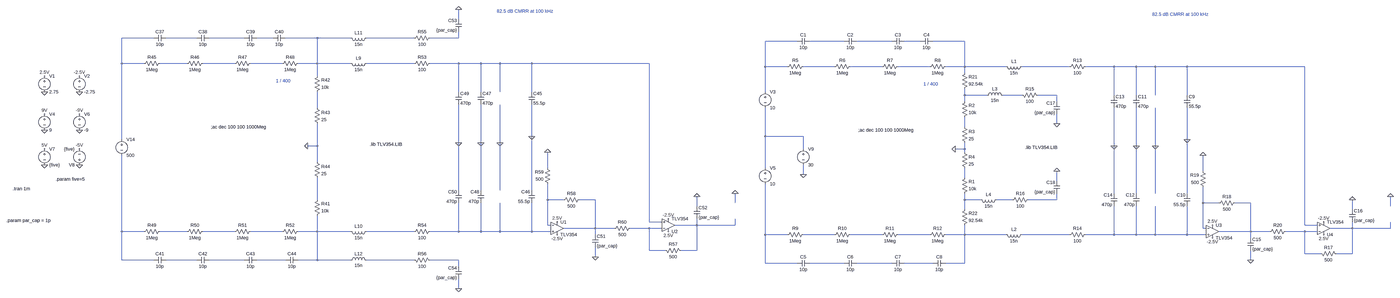
[diagram p0: schematic ratio_analysis.asc, whole sheet]
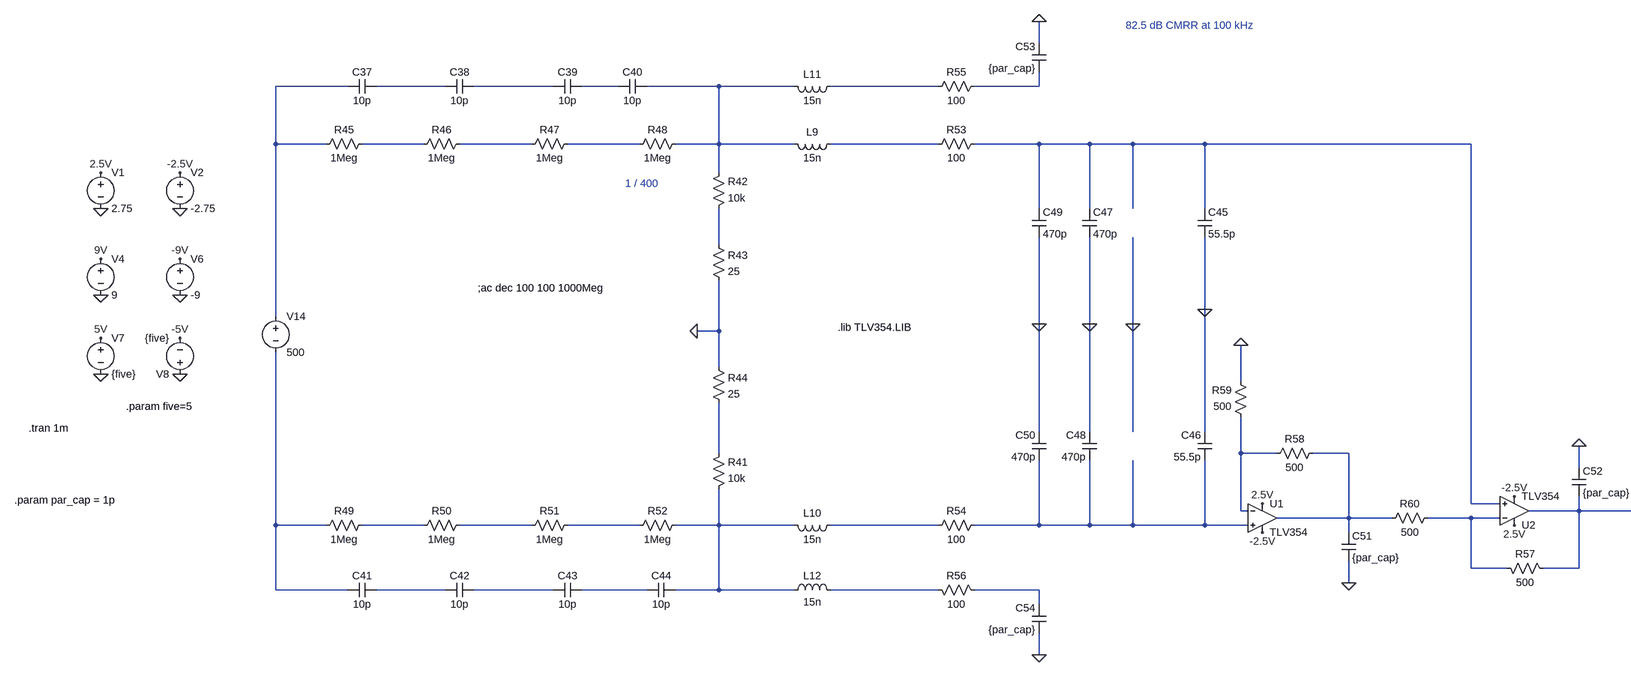
[diagram p1: schematic ratio_analysis.asc, part, row 1 of 1, column 1 of 2]
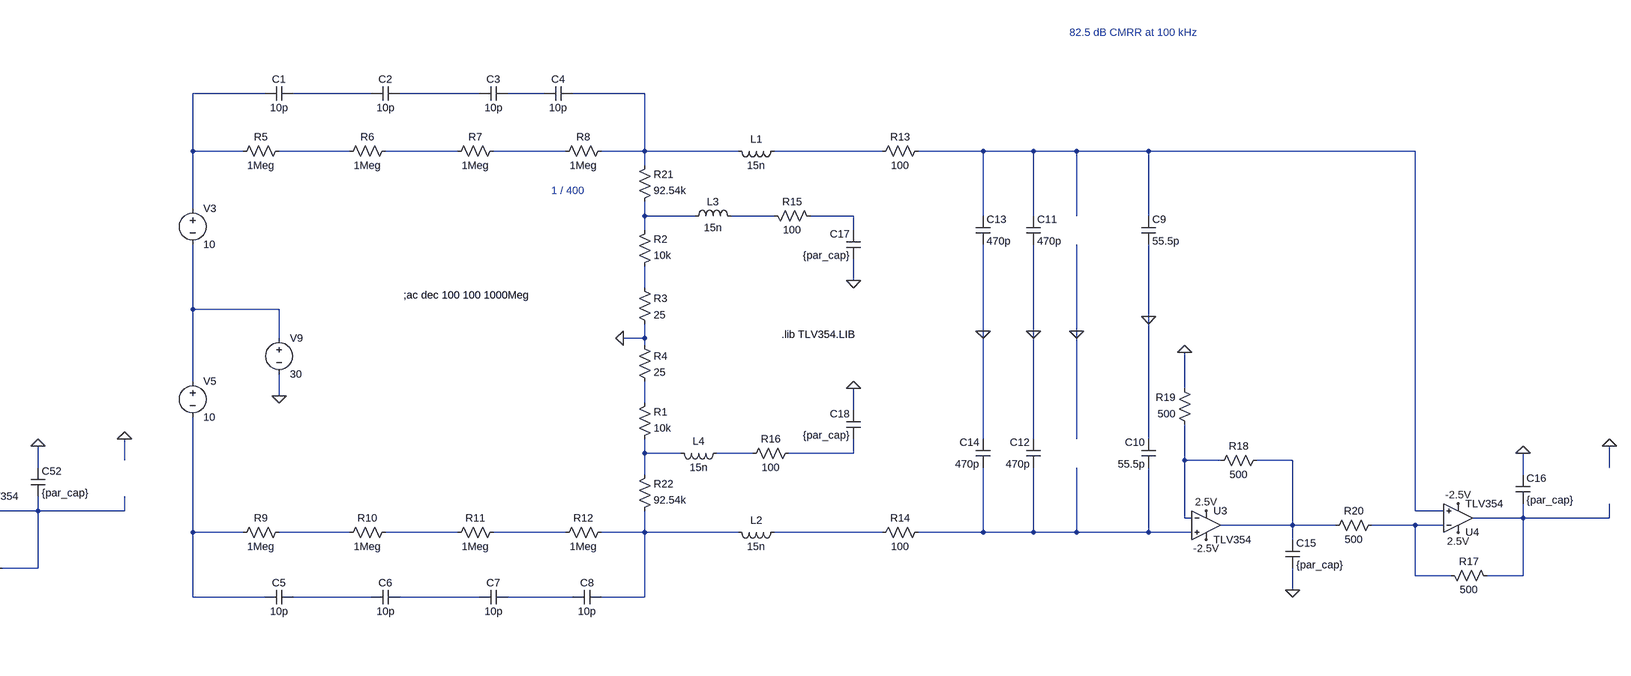
[diagram p2: schematic ratio_analysis.asc, part, row 1 of 1, column 2 of 2]
ratio_analysis.asc, the LTspice schematic file:
Version 4
SHEET 1 7348 2628
WIRE 2144 -544 2144 -592
WIRE 544 -448 384 -448
WIRE 784 -448 608 -448
WIRE 1024 -448 848 -448
WIRE 1168 -448 1088 -448
WIRE 1392 -448 1232 -448
WIRE 1600 -448 1392 -448
WIRE 1920 -448 1680 -448
WIRE 2144 -448 2144 -480
WIRE 2144 -448 2000 -448
WIRE 3936 -432 3776 -432
WIRE 4176 -432 4000 -432
WIRE 4416 -432 4240 -432
WIRE 4560 -432 4480 -432
WIRE 4784 -432 4624 -432
WIRE 384 -320 384 -448
WIRE 496 -320 384 -320
WIRE 736 -320 576 -320
WIRE 976 -320 816 -320
WIRE 1216 -320 1056 -320
WIRE 1392 -320 1392 -448
WIRE 1392 -320 1296 -320
WIRE 1600 -320 1392 -320
WIRE 1920 -320 1680 -320
WIRE 2144 -320 2000 -320
WIRE 2256 -320 2144 -320
WIRE 2352 -320 2256 -320
WIRE 2512 -320 2352 -320
WIRE 3104 -320 2512 -320
WIRE 3776 -304 3776 -432
WIRE 3888 -304 3776 -304
WIRE 4128 -304 3968 -304
WIRE 4368 -304 4208 -304
WIRE 4608 -304 4448 -304
WIRE 4784 -304 4784 -432
WIRE 4784 -304 4688 -304
WIRE 4992 -304 4784 -304
WIRE 5312 -304 5072 -304
WIRE 5536 -304 5392 -304
WIRE 5648 -304 5536 -304
WIRE 5744 -304 5648 -304
WIRE 5904 -304 5744 -304
WIRE 6496 -304 5904 -304
WIRE 4784 -272 4784 -304
WIRE 1392 -256 1392 -320
WIRE 2144 -176 2144 -320
WIRE 2256 -176 2256 -320
WIRE 2352 -176 2352 -320
WIRE 2512 -176 2512 -320
WIRE 3776 -176 3776 -304
WIRE 4784 -160 4784 -192
WIRE 4896 -160 4784 -160
WIRE 5072 -160 4976 -160
WIRE 5248 -160 5152 -160
WIRE 5536 -160 5536 -304
WIRE 5648 -160 5648 -304
WIRE 5744 -160 5744 -304
WIRE 5904 -160 5904 -304
WIRE 4784 -128 4784 -160
WIRE 5248 -128 5248 -160
WIRE 1392 -96 1392 -176
WIRE 5248 -16 5248 -64
WIRE 4784 0 4784 -48
WIRE 2512 48 2512 -112
WIRE 3776 48 3776 -96
WIRE 3968 48 3776 48
WIRE 384 64 384 -320
WIRE 5904 64 5904 -96
WIRE 2144 80 2144 -112
WIRE 2256 80 2256 -112
WIRE 2352 80 2352 -112
WIRE 1392 96 1392 -16
WIRE 1392 96 1344 96
WIRE 5536 96 5536 -96
WIRE 5648 96 5648 -96
WIRE 5744 96 5744 -96
WIRE 3968 112 3968 48
WIRE 4784 112 4784 80
WIRE 4784 112 4736 112
WIRE 4784 128 4784 112
WIRE 1392 176 1392 96
WIRE 2592 208 2592 128
WIRE 3776 208 3776 48
WIRE 5984 224 5984 144
WIRE 3968 240 3968 192
WIRE 4784 256 4784 208
WIRE 5248 272 5248 224
WIRE 2144 320 2144 80
WIRE 2256 320 2256 80
WIRE 2352 320 2352 80
WIRE 2512 320 2512 48
WIRE 5536 336 5536 96
WIRE 5648 336 5648 96
WIRE 5744 336 5744 96
WIRE 5904 336 5904 64
WIRE 1392 368 1392 256
WIRE 2592 368 2592 288
WIRE 2672 368 2592 368
WIRE 2832 368 2752 368
WIRE 4784 368 4784 336
WIRE 4864 368 4784 368
WIRE 5024 368 4944 368
WIRE 5248 368 5248 336
WIRE 5248 368 5104 368
WIRE 3536 384 3536 336
WIRE 5984 384 5984 304
WIRE 6064 384 5984 384
WIRE 6224 384 6144 384
WIRE 3344 400 3344 352
WIRE 6928 400 6928 352
WIRE 4784 416 4784 368
WIRE 6736 416 6736 368
WIRE 3104 480 3104 -320
WIRE 3168 480 3104 480
WIRE 2592 496 2592 368
WIRE 2608 496 2592 496
WIRE 3344 496 3344 464
WIRE 3344 496 3232 496
WIRE 3536 496 3536 464
WIRE 3536 496 3344 496
WIRE 6496 496 6496 -304
WIRE 6560 496 6496 496
WIRE 2832 512 2832 368
WIRE 2832 512 2672 512
WIRE 2928 512 2832 512
WIRE 3104 512 3008 512
WIRE 3168 512 3104 512
WIRE 5984 512 5984 384
WIRE 6000 512 5984 512
WIRE 6736 512 6736 480
WIRE 6736 512 6624 512
WIRE 6928 512 6928 480
WIRE 6928 512 6736 512
WIRE 384 528 384 144
WIRE 496 528 384 528
WIRE 736 528 576 528
WIRE 976 528 816 528
WIRE 1216 528 1056 528
WIRE 1392 528 1392 448
WIRE 1392 528 1296 528
WIRE 1600 528 1392 528
WIRE 1920 528 1680 528
WIRE 2144 528 2144 384
WIRE 2144 528 2000 528
WIRE 2256 528 2256 384
WIRE 2256 528 2144 528
WIRE 2352 528 2352 384
WIRE 2352 528 2256 528
WIRE 2512 528 2512 384
WIRE 2512 528 2352 528
WIRE 2608 528 2512 528
WIRE 6224 528 6224 384
WIRE 6224 528 6064 528
WIRE 6320 528 6224 528
WIRE 6496 528 6400 528
WIRE 6560 528 6496 528
WIRE 2832 544 2832 512
WIRE 3776 544 3776 288
WIRE 3888 544 3776 544
WIRE 4128 544 3968 544
WIRE 4368 544 4208 544
WIRE 4608 544 4448 544
WIRE 4784 544 4784 496
WIRE 4784 544 4688 544
WIRE 4992 544 4784 544
WIRE 5312 544 5072 544
WIRE 5536 544 5536 400
WIRE 5536 544 5392 544
WIRE 5648 544 5648 400
WIRE 5648 544 5536 544
WIRE 5744 544 5744 400
WIRE 5744 544 5648 544
WIRE 5904 544 5904 400
WIRE 5904 544 5744 544
WIRE 6000 544 5904 544
WIRE 6224 560 6224 528
WIRE 3104 624 3104 512
WIRE 3184 624 3104 624
WIRE 3344 624 3344 496
WIRE 3344 624 3264 624
WIRE 6496 640 6496 528
WIRE 6576 640 6496 640
WIRE 6736 640 6736 512
WIRE 6736 640 6656 640
WIRE 2832 656 2832 608
WIRE 384 672 384 528
WIRE 544 672 384 672
WIRE 784 672 608 672
WIRE 1024 672 848 672
WIRE 1232 672 1088 672
WIRE 1392 672 1392 528
WIRE 1392 672 1296 672
WIRE 1600 672 1392 672
WIRE 1920 672 1680 672
WIRE 2144 672 2000 672
WIRE 6224 672 6224 624
WIRE 3776 688 3776 544
WIRE 3936 688 3776 688
WIRE 4176 688 4000 688
WIRE 4416 688 4240 688
WIRE 4624 688 4480 688
WIRE 4784 688 4784 544
WIRE 4784 688 4688 688
WIRE 2144 704 2144 672
WIRE 2144 816 2144 768
FLAG -80 -176 0
FLAG -80 -256 2.5V
FLAG 96 -176 0
FLAG 96 -256 -2.5V
FLAG -80 16 0
FLAG -80 -64 9V
FLAG 96 16 0
FLAG 96 -64 -9V
FLAG -80 192 0
FLAG -80 112 5V
FLAG 96 192 0
FLAG 96 112 -5V
FLAG 1344 96 0
FLAG 2352 80 0
FLAG 2512 48 0
FLAG 3200 528 2.5V
FLAG 3200 464 -2.5V
FLAG 2256 80 0
FLAG 2640 480 2.5V
FLAG 2640 544 -2.5V
FLAG 2144 80 0
FLAG 2832 656 0
FLAG 3344 352 0
FLAG 2144 -592 0
FLAG 2144 816 0
FLAG 3536 336 0
FLAG 2592 128 0
FLAG 4736 112 0
FLAG 5744 96 0
FLAG 5904 64 0
FLAG 6592 544 2.5V
FLAG 6592 480 -2.5V
FLAG 5648 96 0
FLAG 6032 496 2.5V
FLAG 6032 560 -2.5V
FLAG 5536 96 0
FLAG 6224 672 0
FLAG 6736 368 0
FLAG 5248 -16 0
FLAG 5248 224 0
FLAG 6928 352 0
FLAG 5984 144 0
FLAG 3968 240 0
SYMBOL voltage -80 -272 R0
SYMATTR InstName V1
SYMATTR Value 2.75
SYMBOL voltage 96 -272 R0
SYMATTR InstName V2
SYMATTR Value -2.75
SYMBOL voltage -80 -80 R0
SYMATTR InstName V4
SYMATTR Value 9
SYMBOL voltage 96 -80 R0
SYMATTR InstName V6
SYMATTR Value -9
SYMBOL voltage -80 96 R0
SYMATTR InstName V7
SYMATTR Value {five}
SYMBOL voltage 96 208 R180
WINDOW 123 0 0 Left 0
WINDOW 39 0 0 Left 0
SYMATTR InstName V8
SYMATTR Value {five}
SYMBOL res 1376 464 M180
WINDOW 0 36 76 Left 2
WINDOW 3 36 40 Left 2
SYMATTR InstName R41
SYMATTR Value 10k
SYMBOL cap 608 -464 R90
WINDOW 0 0 32 VBottom 2
WINDOW 3 32 32 VTop 2
SYMATTR InstName C37
SYMATTR Value 10p
SYMBOL cap 848 -464 R90
WINDOW 0 0 32 VBottom 2
WINDOW 3 32 32 VTop 2
SYMATTR InstName C38
SYMATTR Value 10p
SYMBOL cap 1088 -464 R90
WINDOW 0 0 32 VBottom 2
WINDOW 3 32 32 VTop 2
SYMATTR InstName C39
SYMATTR Value 10p
SYMBOL cap 1232 -464 R90
WINDOW 0 0 32 VBottom 2
WINDOW 3 32 32 VTop 2
SYMATTR InstName C40
SYMATTR Value 10p
SYMBOL cap 608 656 R90
WINDOW 0 0 32 VBottom 2
WINDOW 3 32 32 VTop 2
SYMATTR InstName C41
SYMATTR Value 10p
SYMBOL cap 848 656 R90
WINDOW 0 0 32 VBottom 2
WINDOW 3 32 32 VTop 2
SYMATTR InstName C42
SYMATTR Value 10p
SYMBOL cap 1088 656 R90
WINDOW 0 0 32 VBottom 2
WINDOW 3 32 32 VTop 2
SYMATTR InstName C43
SYMATTR Value 10p
SYMBOL cap 1296 656 R90
WINDOW 0 0 32 VBottom 2
WINDOW 3 32 32 VTop 2
SYMATTR InstName C44
SYMATTR Value 10p
SYMBOL cap 2496 -176 R0
SYMATTR InstName C45
SYMATTR Value 55.5p
SYMBOL cap 2528 384 R180
WINDOW 0 24 56 Left 2
WINDOW 3 24 8 Left 2
SYMATTR InstName C46
SYMATTR Value 55.5p
SYMBOL res 1376 -160 M180
WINDOW 0 36 76 Left 2
WINDOW 3 36 40 Left 2
SYMATTR InstName R42
SYMATTR Value 10k
SYMBOL voltage 384 48 R0
WINDOW 123 0 0 Left 0
WINDOW 39 0 0 Left 0
SYMATTR InstName V14
SYMATTR Value 500
SYMBOL cap 2240 -176 R0
SYMATTR InstName C47
SYMATTR Value 470p
SYMBOL cap 2272 384 R180
WINDOW 0 24 56 Left 2
WINDOW 3 24 8 Left 2
SYMATTR InstName C48
SYMATTR Value 470p
SYMBOL res 1376 -112 R0
SYMATTR InstName R43
SYMATTR Value 25
SYMBOL res 1376 160 R0
SYMATTR InstName R44
SYMATTR Value 25
SYMBOL cap 2128 -176 R0
SYMATTR InstName C49
SYMATTR Value 470p
SYMBOL cap 2160 384 R180
WINDOW 0 24 56 Left 2
WINDOW 3 24 8 Left 2
SYMATTR InstName C50
SYMATTR Value 470p
SYMBOL cap 2816 544 R0
SYMATTR InstName C51
SYMATTR Value {par_cap}
SYMBOL cap 3328 464 M180
WINDOW 0 24 56 Left 2
WINDOW 3 24 8 Left 2
SYMATTR InstName C52
SYMATTR Value {par_cap}
SYMBOL ind 1696 -336 R90
WINDOW 0 5 56 VBottom 2
WINDOW 3 32 56 VTop 2
SYMATTR InstName L9
SYMATTR Value 15n
SYMBOL res 592 -336 R90
WINDOW 0 0 56 VBottom 2
WINDOW 3 32 56 VTop 2
SYMATTR InstName R45
SYMATTR Value 1Meg
SYMBOL res 832 -336 R90
WINDOW 0 0 56 VBottom 2
WINDOW 3 32 56 VTop 2
SYMATTR InstName R46
SYMATTR Value 1Meg
SYMBOL res 1072 -336 R90
WINDOW 0 0 56 VBottom 2
WINDOW 3 32 56 VTop 2
SYMATTR InstName R47
SYMATTR Value 1Meg
SYMBOL res 1312 -336 R90
WINDOW 0 0 56 VBottom 2
WINDOW 3 32 56 VTop 2
SYMATTR InstName R48
SYMATTR Value 1Meg
SYMBOL res 592 512 R90
WINDOW 0 0 56 VBottom 2
WINDOW 3 32 56 VTop 2
SYMATTR InstName R49
SYMATTR Value 1Meg
SYMBOL res 832 512 R90
WINDOW 0 0 56 VBottom 2
WINDOW 3 32 56 VTop 2
SYMATTR InstName R50
SYMATTR Value 1Meg
SYMBOL res 1072 512 R90
WINDOW 0 0 56 VBottom 2
WINDOW 3 32 56 VTop 2
SYMATTR InstName R51
SYMATTR Value 1Meg
SYMBOL res 1312 512 R90
WINDOW 0 0 56 VBottom 2
WINDOW 3 32 56 VTop 2
SYMATTR InstName R52
SYMATTR Value 1Meg
SYMBOL ind 1696 512 R90
WINDOW 0 5 56 VBottom 2
WINDOW 3 32 56 VTop 2
SYMATTR InstName L10
SYMATTR Value 15n
SYMBOL res 2016 -336 R90
WINDOW 0 0 56 VBottom 2
WINDOW 3 32 56 VTop 2
SYMATTR InstName R53
SYMATTR Value 100
SYMBOL res 2016 512 R90
WINDOW 0 0 56 VBottom 2
WINDOW 3 32 56 VTop 2
SYMATTR InstName R54
SYMATTR Value 100
SYMBOL ind 1696 -464 R90
WINDOW 0 5 56 VBottom 2
WINDOW 3 32 56 VTop 2
SYMATTR InstName L11
SYMATTR Value 15n
SYMBOL res 2016 -464 R90
WINDOW 0 0 56 VBottom 2
WINDOW 3 32 56 VTop 2
SYMATTR InstName R55
SYMATTR Value 100
SYMBOL cap 2160 -480 R180
WINDOW 0 24 56 Left 2
WINDOW 3 24 8 Left 2
SYMATTR InstName C53
SYMATTR Value {par_cap}
SYMBOL ind 1696 688 M270
WINDOW 0 32 56 VTop 2
WINDOW 3 5 56 VBottom 2
SYMATTR InstName L12
SYMATTR Value 15n
SYMBOL res 2016 688 M270
WINDOW 0 32 56 VTop 2
WINDOW 3 0 56 VBottom 2
SYMATTR InstName R56
SYMATTR Value 100
SYMBOL cap 2160 704 M0
SYMATTR InstName C54
SYMATTR Value {par_cap}
SYMBOL res 3280 640 M270
WINDOW 0 32 56 VTop 2
WINDOW 3 0 56 VBottom 2
SYMATTR InstName R57
SYMATTR Value 500
SYMBOL res 2768 352 R90
WINDOW 0 0 56 VBottom 2
WINDOW 3 32 56 VTop 2
SYMATTR InstName R58
SYMATTR Value 500
SYMBOL res 2608 304 R180
WINDOW 0 36 76 Left 2
WINDOW 3 36 40 Left 2
SYMATTR InstName R59
SYMATTR Value 500
SYMBOL res 3024 496 R90
WINDOW 0 0 56 VBottom 2
WINDOW 3 32 56 VTop 2
SYMATTR InstName R60
SYMATTR Value 500
SYMBOL OpAmps\\opamp2 2640 448 R0
SYMATTR InstName U1
SYMATTR Value TLV354
SYMBOL OpAmps\\opamp2 3200 560 M180
SYMATTR InstName U2
SYMATTR Value TLV354
SYMBOL res 4768 352 M180
WINDOW 0 36 76 Left 2
WINDOW 3 36 40 Left 2
SYMATTR InstName R1
SYMATTR Value 10k
SYMBOL cap 4000 -448 R90
WINDOW 0 0 32 VBottom 2
WINDOW 3 32 32 VTop 2
SYMATTR InstName C1
SYMATTR Value 10p
SYMBOL cap 4240 -448 R90
WINDOW 0 0 32 VBottom 2
WINDOW 3 32 32 VTop 2
SYMATTR InstName C2
SYMATTR Value 10p
SYMBOL cap 4480 -448 R90
WINDOW 0 0 32 VBottom 2
WINDOW 3 32 32 VTop 2
SYMATTR InstName C3
SYMATTR Value 10p
SYMBOL cap 4624 -448 R90
WINDOW 0 0 32 VBottom 2
WINDOW 3 32 32 VTop 2
SYMATTR InstName C4
SYMATTR Value 10p
SYMBOL cap 4000 672 R90
WINDOW 0 0 32 VBottom 2
WINDOW 3 32 32 VTop 2
SYMATTR InstName C5
SYMATTR Value 10p
SYMBOL cap 4240 672 R90
WINDOW 0 0 32 VBottom 2
WINDOW 3 32 32 VTop 2
SYMATTR InstName C6
SYMATTR Value 10p
SYMBOL cap 4480 672 R90
WINDOW 0 0 32 VBottom 2
WINDOW 3 32 32 VTop 2
SYMATTR InstName C7
SYMATTR Value 10p
SYMBOL cap 4688 672 R90
WINDOW 0 0 32 VBottom 2
WINDOW 3 32 32 VTop 2
SYMATTR InstName C8
SYMATTR Value 10p
SYMBOL cap 5888 -160 R0
SYMATTR InstName C9
SYMATTR Value 55.5p
SYMBOL cap 5920 400 R180
WINDOW 0 24 56 Left 2
WINDOW 3 24 8 Left 2
SYMATTR InstName C10
SYMATTR Value 55.5p
SYMBOL res 4768 -32 M180
WINDOW 0 36 76 Left 2
WINDOW 3 36 40 Left 2
SYMATTR InstName R2
SYMATTR Value 10k
SYMBOL voltage 3776 -192 R0
WINDOW 123 0 0 Left 0
WINDOW 39 0 0 Left 0
SYMATTR InstName V3
SYMATTR Value 10
SYMBOL cap 5632 -160 R0
SYMATTR InstName C11
SYMATTR Value 470p
SYMBOL cap 5664 400 R180
WINDOW 0 24 56 Left 2
WINDOW 3 24 8 Left 2
SYMATTR InstName C12
SYMATTR Value 470p
SYMBOL res 4768 -16 R0
SYMATTR InstName R3
SYMATTR Value 25
SYMBOL res 4768 112 R0
SYMATTR InstName R4
SYMATTR Value 25
SYMBOL cap 5520 -160 R0
SYMATTR InstName C13
SYMATTR Value 470p
SYMBOL cap 5552 400 R180
WINDOW 0 24 56 Left 2
WINDOW 3 24 8 Left 2
SYMATTR InstName C14
SYMATTR Value 470p
SYMBOL cap 6208 560 R0
SYMATTR InstName C15
SYMATTR Value {par_cap}
SYMBOL cap 6720 480 M180
WINDOW 0 24 56 Left 2
WINDOW 3 24 8 Left 2
SYMATTR InstName C16
SYMATTR Value {par_cap}
SYMBOL ind 5088 -320 R90
WINDOW 0 5 56 VBottom 2
WINDOW 3 32 56 VTop 2
SYMATTR InstName L1
SYMATTR Value 15n
SYMBOL res 3984 -320 R90
WINDOW 0 0 56 VBottom 2
WINDOW 3 32 56 VTop 2
SYMATTR InstName R5
SYMATTR Value 1Meg
SYMBOL res 4224 -320 R90
WINDOW 0 0 56 VBottom 2
WINDOW 3 32 56 VTop 2
SYMATTR InstName R6
SYMATTR Value 1Meg
SYMBOL res 4464 -320 R90
WINDOW 0 0 56 VBottom 2
WINDOW 3 32 56 VTop 2
SYMATTR InstName R7
SYMATTR Value 1Meg
SYMBOL res 4704 -320 R90
WINDOW 0 0 56 VBottom 2
WINDOW 3 32 56 VTop 2
SYMATTR InstName R8
SYMATTR Value 1Meg
SYMBOL res 3984 528 R90
WINDOW 0 0 56 VBottom 2
WINDOW 3 32 56 VTop 2
SYMATTR InstName R9
SYMATTR Value 1Meg
SYMBOL res 4224 528 R90
WINDOW 0 0 56 VBottom 2
WINDOW 3 32 56 VTop 2
SYMATTR InstName R10
SYMATTR Value 1Meg
SYMBOL res 4464 528 R90
WINDOW 0 0 56 VBottom 2
WINDOW 3 32 56 VTop 2
SYMATTR InstName R11
SYMATTR Value 1Meg
SYMBOL res 4704 528 R90
WINDOW 0 0 56 VBottom 2
WINDOW 3 32 56 VTop 2
SYMATTR InstName R12
SYMATTR Value 1Meg
SYMBOL ind 5088 528 R90
WINDOW 0 5 56 VBottom 2
WINDOW 3 32 56 VTop 2
SYMATTR InstName L2
SYMATTR Value 15n
SYMBOL res 5408 -320 R90
WINDOW 0 0 56 VBottom 2
WINDOW 3 32 56 VTop 2
SYMATTR InstName R13
SYMATTR Value 100
SYMBOL res 5408 528 R90
WINDOW 0 0 56 VBottom 2
WINDOW 3 32 56 VTop 2
SYMATTR InstName R14
SYMATTR Value 100
SYMBOL ind 4992 -144 M270
WINDOW 0 32 56 VTop 2
WINDOW 3 5 56 VBottom 2
SYMATTR InstName L3
SYMATTR Value 15n
SYMBOL res 5168 -144 M270
WINDOW 0 32 56 VTop 2
WINDOW 3 0 56 VBottom 2
SYMATTR InstName R15
SYMATTR Value 100
SYMBOL cap 5264 -128 M0
SYMATTR InstName C17
SYMATTR Value {par_cap}
SYMBOL ind 4960 352 R90
WINDOW 0 5 56 VBottom 2
WINDOW 3 32 56 VTop 2
SYMATTR InstName L4
SYMATTR Value 15n
SYMBOL res 5120 352 R90
WINDOW 0 0 56 VBottom 2
WINDOW 3 32 56 VTop 2
SYMATTR InstName R16
SYMATTR Value 100
SYMBOL cap 5264 336 R180
WINDOW 0 24 56 Left 2
WINDOW 3 24 8 Left 2
SYMATTR InstName C18
SYMATTR Value {par_cap}
SYMBOL res 6672 656 M270
WINDOW 0 32 56 VTop 2
WINDOW 3 0 56 VBottom 2
SYMATTR InstName R17
SYMATTR Value 500
SYMBOL res 6160 368 R90
WINDOW 0 0 56 VBottom 2
WINDOW 3 32 56 VTop 2
SYMATTR InstName R18
SYMATTR Value 500
SYMBOL res 6000 320 R180
WINDOW 0 36 76 Left 2
WINDOW 3 36 40 Left 2
SYMATTR InstName R19
SYMATTR Value 500
SYMBOL res 6416 512 R90
WINDOW 0 0 56 VBottom 2
WINDOW 3 32 56 VTop 2
SYMATTR InstName R20
SYMATTR Value 500
SYMBOL OpAmps\\opamp2 6032 464 R0
SYMATTR InstName U3
SYMATTR Value TLV354
SYMBOL OpAmps\\opamp2 6592 576 M180
SYMATTR InstName U4
SYMATTR Value TLV354
SYMBOL res 4768 -176 M180
WINDOW 0 36 76 Left 2
WINDOW 3 36 40 Left 2
SYMATTR InstName R21
SYMATTR Value 92.54k
SYMBOL res 4768 512 M180
WINDOW 0 36 76 Left 2
WINDOW 3 36 40 Left 2
SYMATTR InstName R22
SYMATTR Value 92.54k
SYMBOL voltage 3776 192 R0
WINDOW 123 0 0 Left 0
WINDOW 39 0 0 Left 0
SYMATTR InstName V5
SYMATTR Value 10
SYMBOL voltage 3968 96 R0
WINDOW 123 0 0 Left 0
WINDOW 39 0 0 Left 0
SYMATTR InstName V9
SYMATTR Value 30
TEXT -240 312 Left 2 !.tran 1m
TEXT -24 264 Left 2 !.param five=5
TEXT -272 472 Left 2 !.param par_cap = 1p
TEXT 1184 -232 Left 2 ;1 / 400
TEXT 2336 -584 Left 2 ;82.5 dB CMRR at 100 kHz
TEXT 856 0 Left 2 !;ac dec 100 100 1000Meg
TEXT 1696 88 Left 2 !.lib TLV354.LIB
TEXT 4576 -216 Left 2 ;1 / 400
TEXT 5728 -568 Left 2 ;82.5 dB CMRR at 100 kHz
TEXT 4248 16 Left 2 !;ac dec 100 100 1000Meg
TEXT 5088 104 Left 2 !.lib TLV354.LIB

The netlist it stands for:
* ratio_analysis.asc
V1 2.5V 0 2.75
V2 -2.5V 0 -2.75
V4 9V 0 9
V6 -9V 0 -9
V7 5V 0 {five}
V8 0 -5V {five}
R41 N045 N030 10k
C37 N002 N001 10p
C38 N003 N002 10p
C39 N004 N003 10p
C40 N005 N004 10p
C41 N056 N041 10p
C42 N057 N056 10p
C43 N058 N057 10p
C44 N045 N058 10p
C45 N017 0 55.5p
C46 N047 0 55.5p
R42 N026 N005 10k
V14 N001 N041 500
C47 N017 0 470p
C48 N047 0 470p
R43 N026 0 25
R44 0 N030 25
C49 N017 0 470p
C50 N047 0 470p
C51 N032 0 {par_cap}
C52 N038 0 {par_cap}
L9 N016 N005 15n
R45 N013 N001 1Meg
R46 N014 N013 1Meg
R47 N015 N014 1Meg
R48 N005 N015 1Meg
R49 N042 N041 1Meg
R50 N043 N042 1Meg
R51 N044 N043 1Meg
R52 N045 N044 1Meg
L10 N046 N045 15n
R53 N017 N016 100
R54 N047 N046 100
L11 N006 N005 15n
R55 N007 N006 100
C53 N007 0 {par_cap}
L12 N059 N045 15n
R56 N060 N059 100
C54 N060 0 {par_cap}
R57 N038 N039 500
R58 N032 N031 500
R59 N031 0 500
R60 N039 N032 500
XU1 N047 N031 2.5V -2.5V N032 TLV354  ; pins In+ In- V+ V- OUT
XU2 N017 N039 2.5V -2.5V N038 TLV354  ; pins In+ In- V+ V- OUT
R1 N033 N029 10k
C1 N009 N008 10p
C2 N010 N009 10p
C3 N011 N010 10p
C4 N012 N011 10p
C5 N061 N049 10p
C6 N062 N061 10p
C7 N063 N062 10p
C8 N053 N063 10p
C9 N022 0 55.5p
C10 N055 0 55.5p
R2 N027 N023 10k
V3 N008 N028 10
C11 N022 0 470p
C12 N055 0 470p
R3 N027 0 25
R4 0 N029 25
C13 N022 0 470p
C14 N055 0 470p
C15 N037 0 {par_cap}
C16 N040 0 {par_cap}
L1 N021 N012 15n
R5 N018 N008 1Meg
R6 N019 N018 1Meg
R7 N020 N019 1Meg
R8 N012 N020 1Meg
R9 N050 N049 1Meg
R10 N051 N050 1Meg
R11 N052 N051 1Meg
R12 N053 N052 1Meg
L2 N054 N053 15n
R13 N022 N021 100
R14 N055 N054 100
L3 N024 N023 15n
R15 N025 N024 100
C17 N025 0 {par_cap}
L4 N034 N033 15n
R16 N035 N034 100
C18 N035 0 {par_cap}
R17 N040 N048 500
R18 N037 N036 500
R19 N036 0 500
R20 N048 N037 500
XU3 N055 N036 2.5V -2.5V N037 TLV354  ; pins In+ In- V+ V- OUT
XU4 N022 N048 2.5V -2.5V N040 TLV354  ; pins In+ In- V+ V- OUT
R21 N023 N012 92.54k
R22 N053 N033 92.54k
V5 N028 N049 10
V9 N028 0 30
.tran 1m
.param five=5
.param par_cap = 1p
* 1 / 400
* 82.5 dB CMRR at 100 kHz
;ac dec 100 100 1000Meg
.lib TLV354.LIB
* 1 / 400
* 82.5 dB CMRR at 100 kHz
;ac dec 100 100 1000Meg
.lib TLV354.LIB
.backanno
.end